# EAGLE design RadioBridge (EAGLE 8.2.2)
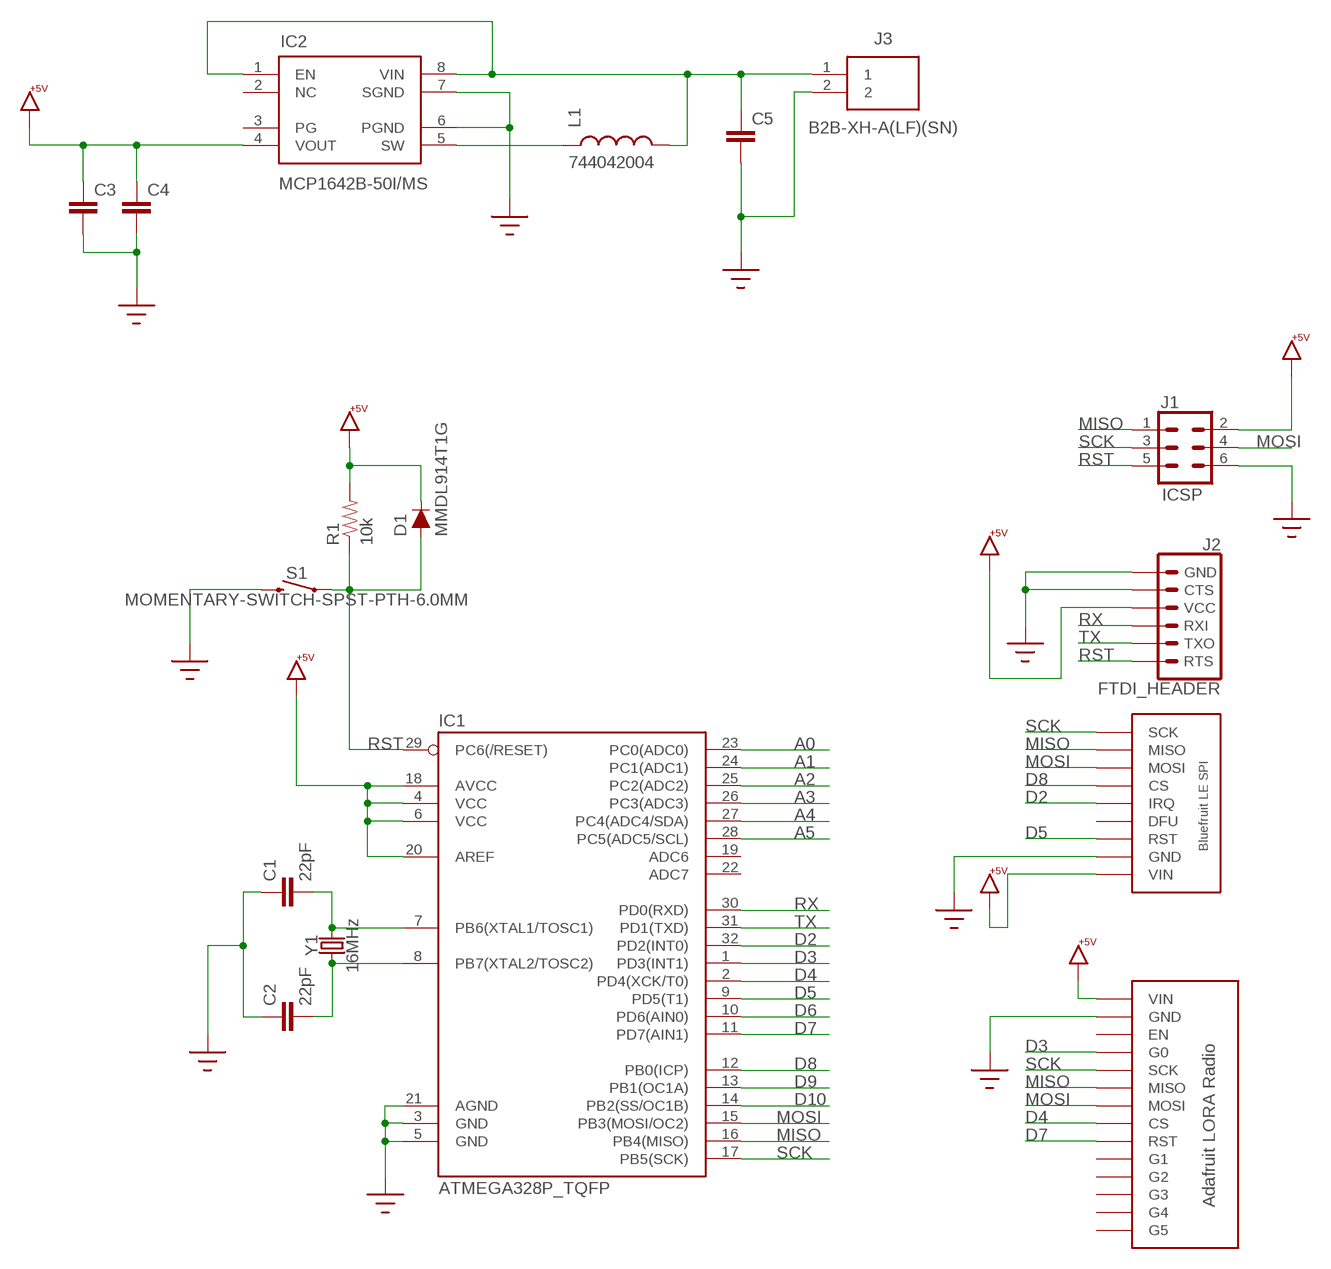
[diagram p0: schematic, sheet 1]

## Parts
C1  22pF  CAP0603-CAP  [0603-CAP]
C2  22pF  CAP0603-CAP  [0603-CAP]
C3  CAP0805  [0805]
C4  CAP0805  [0805]
C5  CAP0805  [0805]
D1  MMDL914T1G  DIODE-BAS16J  [SOD-323]
IC1  ATMEGA328P_TQFP  [TQFP32-08]
IC2  MCP1642B-50I/MS  [MSOP8]
J1  ICSP  CONN_03X22X3_SILK_MALE_PTH  [2X3]
J2  FTDI_HEADER  6_PIN_SERIAL_TARGETLOCK  [1X06_LOCK]
J3  B2B-XH-A(LF)(SN)  [SHDR2W64P0X250_1X2_740X575X700]
L1  744042004  INDUCTOR  [1919(4848_METRIC)]
R1  10k  RESISTOR0603-RES  [0603-RES]
S1  MOMENTARY-SWITCH-SPST-PTH-6.0MM  [TACTILE_SWITCH_PTH_6.0MM]
U$1  BLUEFRUIT_LE_FRIEND_SPI  [BLUEFRUIT_LE_FRIEND_SPI]
U$2  ADAFRUIT_LORA_RADIO  [ADAFRUIT_LORA_RADIO]
Y1  16MHz  CRYSTAL-16MHZSMD-5X3.2  [CRYSTAL-SMD-5X3.2-4PAD]

## Nets
+5V: C3.1 C4.1 D1.C IC1.4(VCC) IC1.6(VCC) IC1.18(AVCC) IC1.20(AREF) IC2.4(VOUT) J1.2 J2.4(VCC) R1.2 U$1.P$9(VIN) U$2.P$1(VIN)
A0: IC1.23(PC0(ADC0))
A1: IC1.24(PC1(ADC1))
A2: IC1.25(PC2(ADC2))
A3: IC1.26(PC3(ADC3))
A4: IC1.27(PC4(ADC4/SDA))
A5: IC1.28(PC5(ADC5/SCL))
D2: IC1.32(PD2(INT0)) U$1.P$5(IRQ)
D3: IC1.1(PD3(INT1)) U$2.P$4(G0)
D4: IC1.2(PD4(XCK/T0)) U$2.P$8(CS)
D5: IC1.9(PD5(T1)) U$1.P$7(RST)
D6: IC1.10(PD6(AIN0))
D7: IC1.11(PD7(AIN1)) U$2.P$9(RST)
D8: IC1.12(PB0(ICP)) U$1.P$4(CS)
D9: IC1.13(PB1(OC1A))
D10: IC1.14(PB2(SS/OC1B))
GND: C1.1 C2.1 C3.2 C4.2 C5.2 IC1.3(GND) IC1.5(GND) IC1.21(AGND) IC2.6(PGND) IC2.7(SGND) J1.6 J2.5(CTS) J2.6(GND) J3.2 S1.3 U$1.P$8(GND) U$2.P$2(GND)
MISO: IC1.16(PB4(MISO)) J1.1 U$1.P$2(MISO) U$2.P$6(MISO)
MOSI: IC1.15(PB3(MOSI/OC2)) J1.4 U$1.P$3(MOSI) U$2.P$7(MOSI)
N$1: C1.2 IC1.7(PB6(XTAL1/TOSC1)) Y1.3
N$2: C2.2 IC1.8(PB7(XTAL2/TOSC2)) Y1.1
REG_SW: IC2.5(SW) L1.P$1
REG_VIN: C5.1 IC2.1(EN) IC2.8(VIN) J3.1 L1.P$2
RST: D1.A IC1.29(PC6(/RESET)) J1.5 J2.1(RTS) R1.1 S1.1
RX: IC1.30(PD0(RXD)) J2.3(RXI)
SCK: IC1.17(PB5(SCK)) J1.3 U$1.P$1(SCK) U$2.P$5(SCK)
TX: IC1.31(PD1(TXD)) J2.2(TXO)
Unconnected: IC1.19(ADC6) IC1.22(ADC7) IC2.2(NC) IC2.3(PG) U$1.P$6(DFU) U$2.P$3(EN) U$2.P$10(G1) U$2.P$11(G2) U$2.P$12(G3) U$2.P$13(G4) U$2.P$14(G5)

## Library data of the parts
C1-C5 = SparkFun-Passives:CAP: Capacitor Standard 0603 ceramic capacitor, and 0.1" leaded capacitor.
D1 = SparkFun-DiscreteSemi:DIODE: Diode These are standard reverse protection diodes and small signal diodes. SparkFun Products: SparkFun SparkPunk Sound Kit <https://www.sparkfun.com/products/11177> SparkFun ESP8266 Thing <https://www.sparkfun.com/products/13231>; PROD_ID: DIO-09646; VALUE: 250mA/100V
IC1 = SparkFun-IC-Microcontroller:ATMEGA328P_TQFP: Popular 328P in QFP Storefront component: ATmega328 - TQFP <https://www.sparkfun.com/products/13448> (COM-13448) Datasheet <http://www.sparkfun.com/datasheets/Components/SMD/ATMega328.pdf> SparkFun Products SparkFun RedBoard - Programmed with Arduino <https://www.sparkfun.com/products/12757> (DEV-12757) Arduino Pro Mini 328 - 5V/16MHz <https://www.sparkfun.com/products/11113> (DEV-11113) Arduino Pro Mini 328 - 3.3V/8MHz <https://www.sparkfun.com/products/11114> (DEV-11114) SparkFun OpenLog <https://www.sparkfun.com/products/13712> (DEV-13712) SparkFun MicroView - OLED Arduino Module <https://www.sparkfun.com/products/12923> (DEV-12923) SparkFun Digital Sandbox <https://www.sparkfun.com/products/12651> (DEV-12651) SparkFun PicoBoard <https://www.sparkfun.com/products/11888> (WIG-11888) Arduino Fio <https://www.sparkfun.com/products/10116> (DEV-10116) LilyPad Arduino 328 Main Board <https://www.sparkfun.com/products/13342> (DEV-13342) SparkFun RedStick <https://www.sparkfun.com/products/13741> (DEV-13741) LilyPad MP3 <https://www.sparkfun.com/products/11013> (DEV-11013) LilyPad Arduino SimpleSnap <https://www.sparkfun.com/products/10941> (DEV-10941) SparkFun Stepoko <https://www.sparkfun.com/products/13899> (ROB-13899) SparkFun Geiger Counter <https://www.sparkfun.com/products/11345> (SEN-11345) SparkFun EL Sequencer <https://www.sparkfun.com/products/12781> (COM-12781) Arduino Pro 328 - 5V/16MHz <https://www.sparkfun.com/products/10915> (DEV-10915) CryptoCape <https://www.sparkfun.com/products/12773> (DEV-12773) SparkFun IR Thermometer Evaluation Board - MLX90614 <https://www.sparkfun.com/products/10740> (SEN-10740) SparkFun RedBot Mainboard <https://www.sparkfun.com/products/12097> (ROB-12097) Arduino Pro 328 - 3.3V/8MHz <https://www.sparkfun.com/products/10914> (DEV-10914) SparkFun Block for Intel® Edison - Arduino <https://www.sparkfun.com/products/13036> (DEV-13036) SparkFun Simon Says - Surface Mount Soldering Kit <https://www.sparkfun.com/products/10935> (KIT-10935) SparkFun 7-Segment Serial Display - Red <https://www.sparkfun.com/products/11441> (COM-11441) SparkFun 7-Segment Serial Display - White <https://www.sparkfun.com/products/11629> (COM-11629) SparkFun 7-Segment Serial Display - Yellow <https://www.sparkfun.com/products/11443> (COM-11443) SparkFun 7-Segment Serial Display - Kelly Green <https://www.sparkfun.com/products/11440> (COM-11440) SparkFun 7-Segment Serial Display - Blue <https://www.sparkfun.com/products/11442> (COM-11442) SparkFun OpenSegment Serial Display - 20mm (Blue) <https://www.sparkfun.com/products/11647> (COM-11647) SparkFun OpenSegment Serial Display - 20mm (Green) <https://www.sparkfun.com/products/11646> (COM-11646) SparkFun OpenSegment Serial Display - 20mm (White) <https://www.sparkfun.com/products/11648> (COM-11648) SparkFun OpenSegment Serial Display - 20mm (Red) <https://www.sparkfun.com/products/11644> (COM-11644) SparkFun OpenSegment Serial Display - 20mm (Yellow) <https://www.sparkfun.com/products/11645> (COM-11645) SparkFun OpenSegment Shield <https://www.sparkfun.com/products/13190> (DEV-13190); PROD_ID: IC-09069
IC2 = SparkFun-IC-Power:MCP1642B-50I/MS
J1 = SparkFun-Connectors:CONN_03X2: Multi connection point. Often used as Generic Header-pin footprint for 0.1 inch spaced/style header connections You can populate with any combo of single row headers, but if you'd like an exact match, check these: Header - 2x3 (Male, 0.1") <https://www.sparkfun.com/products/12807> (PRT-12807) Header - 2x3 (Female, 0.1") <https://www.sparkfun.com/products/13010> (PRT-13010) 2x3 Pin Shrouded Header <https://www.sparkfun.com/products/10877> (PRT-10877) On any of the 0.1 inch spaced packages, you can populate with these: Break Away Headers - Straight <https://www.sparkfun.com/products/116> (PRT-00116) Break Away Male Headers - Right Angle <https://www.sparkfun.com/products/553> (PRT-00553) Female Headers <https://www.sparkfun.com/products/115> (PRT-00115) Break Away Headers - Machine Pin <https://www.sparkfun.com/products/117> (PRT-00117) Break Away Female Headers - Swiss Machine Pin <https://www.sparkfun.com/products/743> (PRT-00743) Special note: the shrouded connector mates well with our 3x2 ribbon cables: Ribbon Crimp Connector - 6-pin (2x3, Female) <https://www.sparkfun.com/products/10651> (PRT-10651) Ribbon Cable - 6 wire (15ft) <https://www.sparkfun.com/products/10646> (PRT-10646); PROD_ID: CONN-09701
J2 = TinkerTech:6_PIN_SERIAL_TARGET: 6-pin header connection for use with the "FTDI BASIC" pinout - TARGET SIDE. Also known as "Arduino Serial Program Header". It is used to mate with our FTDI Basic serial programmers using the Arduino IDE. Note, this device has "TARGET" in the name. It is intended to be used on a design that contains a target micro-controller that you wish to program. The "sister" device, named "CABLE" is inteneded to be used on a design that usually lives on the end of your USB cable and prvides the converter chip (FTDI232 or FTDI231x) to commnicate serial RX/TX. You can populate with some of these: Break Away Headers - Straight <https://www.sparkfun.com/products/116> (PRT-00116) For reference (or to suit your programming needs) check out these designs: SparkFun FTDI Basic Breakout - 5V <https://www.sparkfun.com/products/9716> (DEV-09716) SparkFun FTDI Basic Breakout - 3.3V <https://www.sparkfun.com/products/9873> (DEV-09873) SparkFun FTDI SmartBasic <https://www.sparkfun.com/products/12935> (DEV-12935) SparkFun Beefy 3 - FTDI Basic Breakout <https://www.sparkfun.com/products/13746> (DEV-13746)
J3 = B2B-XH-A(LF)(SN):B2B-XH-A(LF)(SN): JST XH Series, 2.5mm Pitch 2 Way 1 Row Straight PCB Header, Solder Termination, 3A <https://componentsearchengine.com/Images/3/B2B-XH-A%28LF%29%28SN%29.jpg> Source: Datasheet <http://docs-europe.electrocomponents.com/webdocs/1357/0900766b81357f2f.pdf>; DESCRIPTION: JST XH Series, 2.5mm Pitch 2 Way 1 Row Straight PCB Header, Solder Termination, 3A; HEIGHT: 7mm; MANUFACTURER_NAME: JST (JAPAN SOLDERLESS TERMINALS); MANUFACTURER_PART_NUMBER: B2B-XH-A(LF)(SN); RS_PART_NUMBER: 8201554; SUPPLIER_NAME: RS
L1 = SparkFun-Passives:INDUCTOR: Inductors Basic Inductor/Choke - 0603 and 1206. Footprints are not proven and vary greatly between part numbers.
R1 = SparkFun-Passives:RESISTOR: Resistor Basic schematic elements and footprints for 0603, 1206, and PTH resistors.
S1 = SparkFun-Switches:MOMENTARY-SWITCH-SPST: Momentary Switch (Pushbutton) - SPST Normally-open (NO) SPST momentary switches (buttons, pushbuttons). Variants PTH-12MM - 12mm square, through-hole Momentary Pushbutton Switch - 12mm Square <https://www.sparkfun.com/products/9190> (COM-09190) PTH-6.0MM, PTH-6.0MM-KIT - 6.0mm square, through-hole Mini Pushbutton Switch <https://www.sparkfun.com/products/97> (COM-00097) KIT package intended for soldering kit's - only one side of pads' copper is exposed. PTH-RIGHT-ANGLE-KIT - Right-angle, through-hole Right Angle Tactile Button <https://www.sparkfun.com/products/10791> - Used on SparkFun BigTime Watch Kit <https://www.sparkfun.com/products/11734> SMD-12MM - 12mm square, surface-mount Tactile Button - SMD (12mm) <https://www.sparkfun.com/products/12993> (COM-12993) Used on SparkFun PicoBoard <https://www.sparkfun.com/products/11888> SMD-4.5MM - 4.5mm Square Trackball Switch Used on SparkFun Blackberry Trackballer Breakout <https://www.sparkfun.com/products/13169> SMD-4.6MMX2.8MM - 4.60mm x 2.80mm, surface mount Used on SparkFun SAMD21 Mini Breakout <https://www.sparkfun.com/products/13664> SMD-5.2MM, SMD-5.2-REDUNDANT - 5.2mm square, surface-mount Mini Pushbutton Switch - SMD <https://www.sparkfun.com/products/8720> (COM-08720) Used on Arduino Pro Mini <https://www.sparkfun.com/products/11114> REDUNDANT package connects both switch circuits together SMD-6.0X3.5MM - 6.0 x 3.5mm, surface mount Momentary Reset Switch SMD <https://www.sparkfun.com/products/8229> (COM-08229) SMD-6.2MM-TALL - 6.2mm square, surface mount Tactile Button - SMD (6mm) <https://www.sparkfun.com/products/12992> Used on SparkFun Digital Sandbox <https://www.sparkfun.com/products/12651> SMD-RIGHT-ANGLE - Right-angle, surface mount Used on SparkFun Block for Intel® Edison - Arduino <https://www.sparkfun.com/products/13036>; PROD_ID: SWCH-08441; SF_SKU: COM-00097
U$1 = TinkerTech:BLUEFRUIT_LE_FRIEND_SPI
U$2 = TinkerTech:ADAFRUIT_LORA_RADIO
Y1 = SparkFun-Clocks:CRYSTAL-16MHZ: 16MHz Crystal Digikey Example <http://www.digikey.com/product-search/en?keywords=535-9122-1-ND> Frequency: 16MHz Frequency Stability: ±50ppm Frequency Tolerance: ±20ppm Load Capacitance: 18pF SparkFun Products: Pro Micro -5V/16MHz <https://www.sparkfun.com/products/12640> SparkFun Serial Enabled LCD Kit <https://www.sparkfun.com/products/10097>; PROD_ID: XTAL-08218; SF_ID: COM-00094

## Board
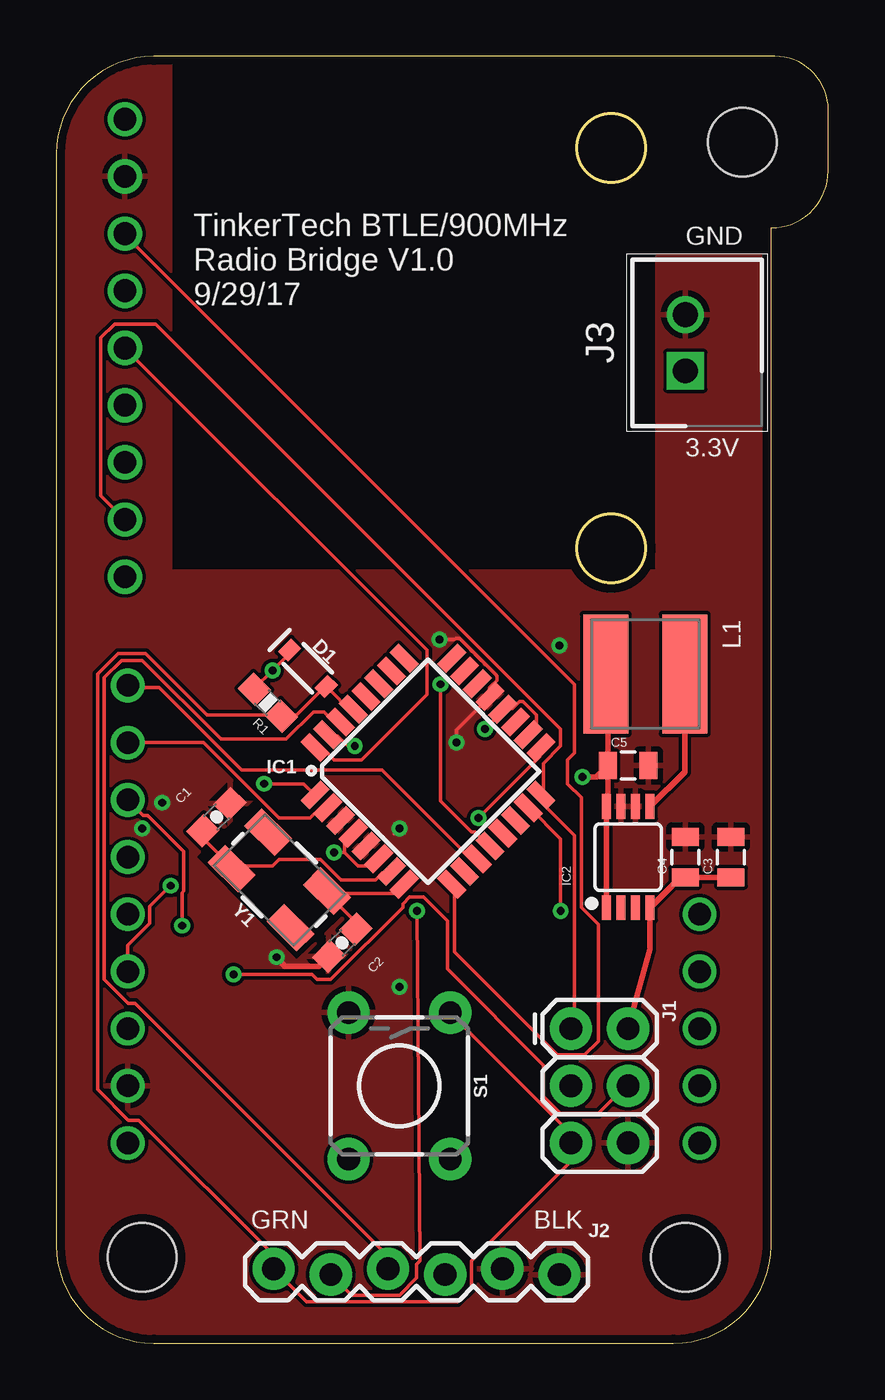
[diagram p1: board, top side]
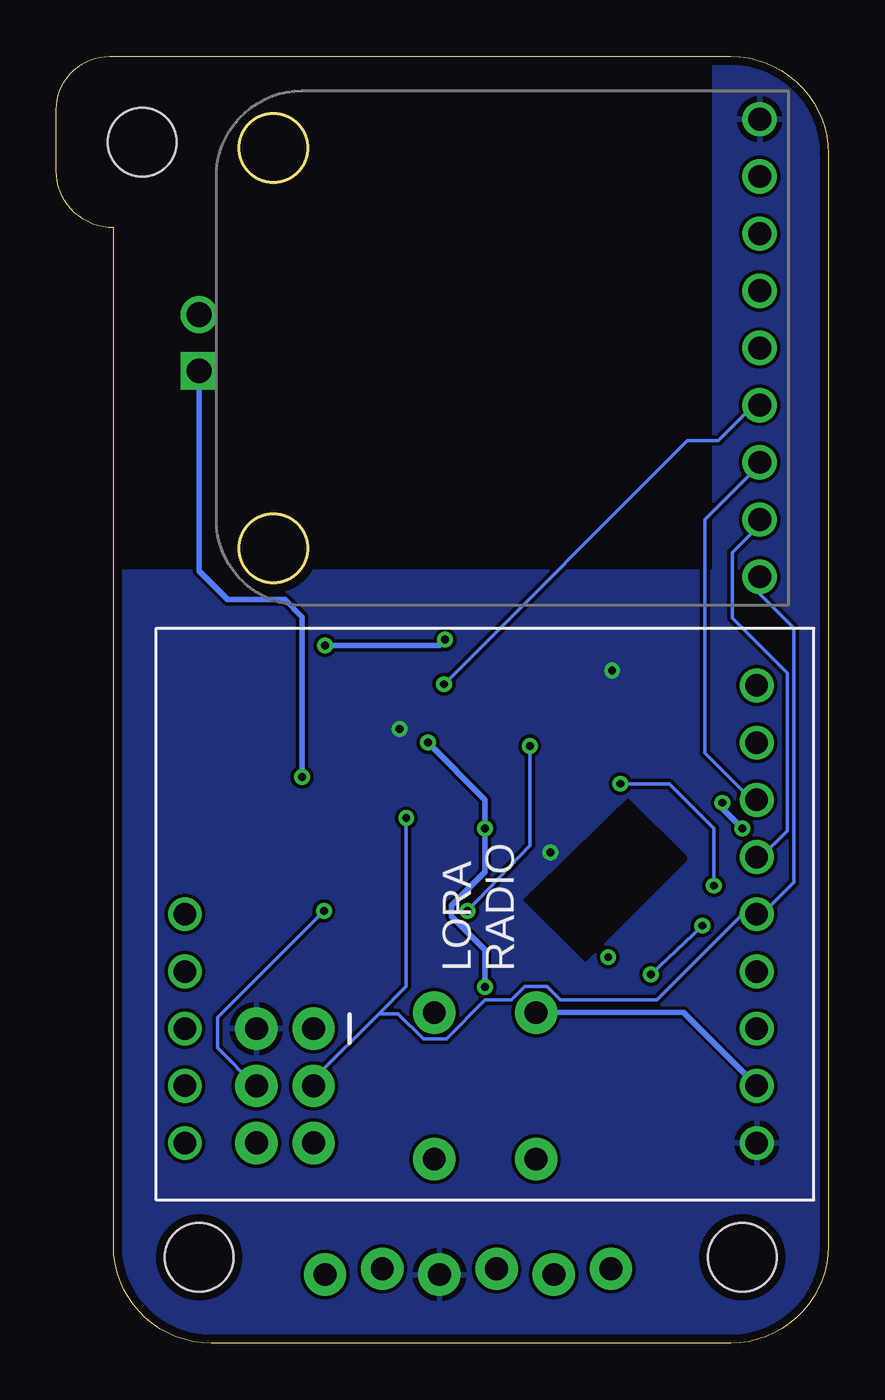
[diagram p2: board, bottom side, seen from below]

Size 34.29 x 57.15 mm. Coordinates in mm from the lower left corner, seen from the top.
Outline: 31.91,57.15 4.34,57.15 arc90 0,52.81 0,4.34 arc90 4.34,0 27.41,0 arc90 31.75,4.34 31.75,49.53 arc90 34.29,52.07 34.29,54.77 arc90 31.91,57.15
Copper layers (1*16): Top 0.0356mm / dielectric 1.5011mm / Bottom 0.0356mm
Design rules "oshpark-2layer *": minimum track width 6mil, minimum drill 13mil, track to track 6mil, track to pad 6mil, pad to pad 6mil, via to via 6mil, smd to smd 6mil, copper to edge 15mil, drill to drill 6mil, minimum pad ring 7mil, minimum via ring 7mil, stop-mask expansion 2.5mil, vias tented up to drill 15mil, thermal gap 10mil
Holes 3.05 mm at 3.81,3.81 30.48,53.34 27.94,3.81
tKeepout: area 1,1 to 6.6,6.6; area 27.7,50.5 to 33.3,56.1; area 25.1,1 to 30.7,6.6
tRestrict: 10 lines

### Footprints (pad centres in the part's own frame; a part is rotated, then mirrored left to right if it is on the bottom)
0603-CAP = smd 1.1 x 1: 1 -0.85,0; 2 0.85,0
0805 = smd 0.8 x 1.2: 1 -0.9,0; 2 0.9,0
SOD-323 = smd 0.63 x 0.83: A 1.15,0; C -1.15,0
TQFP32-08 = smd 1.27 x 0.559: 1 -4.293,2.8; 2 -4.293,2; 3 -4.293,1.2; 4 -4.293,0.4; 5 -4.293,-0.4; 6 -4.293,-1.2; 7 -4.293,-2; 8 -4.293,-2.8; 17 4.293,-2.8; 18 4.293,-2; 19 4.293,-1.2; 20 4.293,-0.4; 21 4.293,0.4; 22 4.293,1.2; 23 4.293,2; 24 4.293,2.8 | smd 0.559 x 1.27: 9 -2.8,-4.293; 10 -2,-4.293; 11 -1.2,-4.293; 12 -0.4,-4.293; 13 0.4,-4.293; 14 1.2,-4.293; 15 2,-4.293; 16 2.8,-4.293; 25 2.8,4.293; 26 2,4.293; 27 1.2,4.293; 28 0.4,4.293; 29 -0.4,4.293; 30 -1.2,4.293; 31 -2,4.293; 32 -2.8,4.293
MSOP8 = smd 0.4 x 1.1: 1 -0.975,-2.25; 2 -0.325,-2.25; 3 0.325,-2.25; 4 0.975,-2.25; 5 0.975,2.25; 6 0.325,2.25; 7 -0.325,2.25; 8 -0.975,2.25
2X3 = drill 1.016 pad 1.88: 1 0,0; 2 0,2.54; 3 2.54,0; 4 2.54,2.54; 5 5.08,0; 6 5.08,2.54
1X06_LOCK = drill 1.016 pad 1.88: 1 0,0; 2 2.54,-0.254; 3 5.08,0; 4 7.62,-0.254; 5 10.16,0; 6 12.7,-0.254
SHDR2W64P0X250_1X2_740X575X700 = drill 1.1 pad 1.65 square: 1 0,0 | drill 1.1 pad 1.65: 2 2.5,0
1919(4848_METRIC) = smd 5.3 x 2: P$1 0,1.75; P$2 0,-1.75
0603-RES = smd 1.1 x 1: 1 -0.85,0; 2 0.85,0
TACTILE_SWITCH_PTH_6.0MM = drill 1.016 pad 1.88: 1 -3.251,2.261; 2 3.251,2.261; 3 -3.251,-2.261; 4 3.251,-2.261
BLUEFRUIT_LE_FRIEND_SPI = drill 1.016: P$1 -10.16,-11.43; P$2 -7.62,-11.43; P$3 -5.08,-11.43; P$4 -2.54,-11.43; P$5 0,-11.43; P$6 2.54,-11.43; P$7 5.08,-11.43; P$8 7.62,-11.43; P$9 10.16,-11.43
ADAFRUIT_LORA_RADIO = drill 1: P$1 -10.16,-12.065; P$2 -7.62,-12.065; P$3 -5.08,-12.065; P$4 -2.54,-12.065; P$5 0,-12.065; P$6 2.54,-12.065; P$7 5.08,-12.065; P$8 7.62,-12.065; P$9 10.16,-12.065; P$10 -10.16,13.335; P$11 -7.62,13.335; P$12 -5.08,13.335; P$13 -2.54,13.335; P$14 0,13.335
CRYSTAL-SMD-5X3.2-4PAD = smd 1.9 x 1.1: 1 -1.85,-1.15; 2 1.85,-1.15; 3 1.85,1.15; 4 -1.85,1.15

### Placement (x,y rotation side)
C1  7.11,23.37 225 top
C2  12.7,17.78 45 top
C3  29.97,21.59 90 top
C4  27.94,21.59 90 top
C5  25.4,25.65 0 top
D1  11.18,29.97 315 top
IC1  16.51,25.4 45 top
IC2  25.4,21.59 0 top
J1  22.86,13.97 270 top
J2  9.65,3.3 0 top
J3  27.94,43.18 90 top
L1  26.16,29.72 270 top
R1  9.4,28.45 135 top
S1  15.24,11.43 270 top
U$1  14.48,44.2 90 bottom
U$2  15.24,19.05 90 bottom
Y1  9.91,20.57 135 top

### Tracks (layer width: path | path; a pad name or v marks a point on that pad's centre or on a via)
+5V  (via drill 0.35)
  Top 0.152: D1.C 10.21,30.79 10.21,30.48 v9.6,29.87 8.84,29.11 R1.2 | 12.8,21.79 13.41,21.18 13.87,21.18 14.17,21.49 IC1.6 | 12.8,21.79 12.8,22.25 13.11,22.55 IC1.4 | IC1.18 21.03,27.13 21.34,27.43 21.34,27.89 20.73,28.5 20.57,28.5 20.27,28.19 19.96,28.19 IC1.20 19.81,28.04 v19.05,27.28 | v12.34,21.79 12.8,21.79
  Top 0.254: C3.1 C4.1 27.73,20.69 IC2.4 26.38,17.48 J1.2
  pour Bottom: 0,57.15 5.08,57.15 5.08,34.29 31.75,34.29 31.75,0 0,0
D2
  Top 0.152: U$1.P$5 16.46,30.79 16.46,28.8 13.56,25.91 12.34,25.91 11.89,26.36 11.58,26.36 IC1.32
D3  (via drill 0.35)
  Top 0.152: IC1.1 10.99,24.84 v9.24,24.84 | v5.08,20.32 4.16,19.4 4.16,18.64 3.17,17.66 U$2.P$4
  Bottom 0.152: v5.08,20.32 5.08,22.86 7.06,24.84 v9.24,24.84
D4
  Top 0.152: U$2.P$8 6.55,26.67 9.91,23.32 11.28,23.32 11.73,23.77 12.04,23.77 IC1.2
D5
  Top 0.152: IC1.9 17.68,20.27 17.68,17.37 22.25,12.8 23.47,12.8 24.08,13.41 24.08,18.59 23.32,19.36 23.32,24.23 22.71,24.84 22.71,25.91 23.01,26.21 23.01,29.26 3.05,49.23 U$1.P$7
D7
  Top 0.152: IC1.11 18.59,21.64 18.29,21.64 14.48,25.45 8.23,25.45 4.57,29.11 3.2,29.11 U$2.P$9
D8  (via drill 0.35)
  Top 0.152: v17.07,29.26 17.07,24.08 18.44,22.71 18.59,22.71 19.2,22.1 IC1.12
  Bottom 0.152: v17.07,29.26 6.25,40.08 4.88,40.08 3.35,41.6 3.05,41.6 U$1.P$4
GND  (via drill 0.35)
  Top 0.152: v17.02,31.24 17.67,31.24 17.72,31.29 17.91,31.29 19.57,29.63 19.57,29.44 19.26,29.13 IC1.21 17.78,27.24 v17.78,26.67 | 15,22.62 v15.24,22.86
  Top 0.254: C2.1 11.66,16.74 10.16,16.74 9.78,17.12 v9.78,17.14
  Bottom 0.254: v17.02,31.24 17.27,30.99 v22.35,30.99 | v17.78,26.67 15.24,24.13 v15.24,22.86 15.24,20.94 16.74,19.44 16.74,18.96 15.24,17.47 v15.24,15.82 | U$2.P$2 6.43,14.68 S1.3 | v3.81,22.86 4.7,23.75 v4.7,24
  pour Top: 0,57.15 5.08,57.15 5.08,34.29 26.67,34.29 26.67,48.26 31.75,48.26 31.75,0 0,0
MISO
  Top 0.152: J1.1 22.86,14.02 23.01,14.17 23.01,22.55 21.64,23.93 21.64,24.23 IC1.16 21.64,24.38 21.64,25.76 22.4,26.52 22.4,27.28 4.42,45.26 2.59,45.26 1.98,44.65 1.98,37.64 U$1.P$2
  Bottom 0.152: U$1.P$2 3.05,36.32 4.27,35.1 4.27,32.21 1.83,29.77 1.83,22.76 3.05,21.54 U$2.P$6
MOSI  (via drill 0.35)
  Top 0.152: v22.4,19.2 22.4,22.4 21.03,23.77 IC1.15 | v7.87,16.38 11.35,16.38 11.58,16.15 12.19,16.15 15.39,19.36 15.39,19.51 15.7,19.81 16.31,19.81 17.37,18.75 17.37,16.61 21.64,12.34 21.64,10.97 22.4,10.21 24.08,10.21 25.3,11.43 J1.4 | U$2.P$7 3.86,23.44 4.05,23.44 5.66,21.83 5.66,20.08 5.59,20.01 v5.59,18.54
  Bottom 0.152: U$2.P$7 3.2,24.23 3.5,24.23 5.49,26.21 5.49,36.58 3.05,39.01 U$1.P$3 | v22.4,19.2 27.13,14.48 27.13,13.11 25.45,11.43 J1.4 | v7.87,16.38 v5.59,18.54
N$1
  Top 0.152: C1.2 6.55,22.71 6.55,22.4 7.77,21.18 Y1.3 7.92,21.18 9.6,21.18 9.91,21.49 11.73,21.49 12.65,20.57 14.17,20.57 14.48,20.88 14.78,20.88 IC1.7
N$2
  Top 0.152: 12.04,19.96 13.26,18.75 13.26,18.44 C2.2 13.41,18.29 | 12.04,19.96 Y1.1 | IC1.8 15.39,20.27 15.09,19.96 12.04,19.96
N$3
  cutout Bottom: 6.35,21.59 8.89,24.13 13.46,19.68 10.79,17.02 6.35,21.46
N$4
  cutout Top: 8.89,24.13 13.34,19.68 10.67,17.14 6.35,21.59
REG_SW
  Top 0.254: L1.P$1 27.91,25.38 IC2.5
REG_VIN  (via drill 0.35)
  Top 0.254: C5.1 24.5,23.91 IC2.8 IC2.1 | C5.1 23.99,25.15 v23.37,25.15 | L1.P$2 24.5,29.63 C5.1
  Bottom 0.254: v23.37,25.15 23.37,32.26 24.13,33.02 26.67,33.02 27.94,34.29 J3.1
RST
  Top 0.152: S1.1 17.53,14.63 22.86,9.3 J1.5 22.86,8.08 18.44,3.66 18.44,2.44 17.83,1.83 11.12,1.83 J2.1 9.6,3.35 9.6,3.96 3.66,9.91 3.2,9.91 1.83,11.28 1.83,29.72 2.74,30.63 3.96,30.63 6.71,27.89 9.91,27.89 R1.1 10.06,27.89 10.67,27.89 11.89,29.11 D1.A 12.04,29.11 13.11,28.04 IC1.29
RX
  Top 0.152: IC1.30 12.5,27.74 12.19,27.74 11.89,28.04 11.43,28.04 10.21,26.82 7.32,26.82 3.81,30.33 2.9,30.33 2.13,29.57 2.13,16.15 3.2,15.09 3.5,15.09 14.63,3.96 14.63,3.35 J2.3
SCK  (via drill 0.35)
  Top 0.152: v18.75,23.32 21.49,26.06 21.49,26.36 IC1.17
  Bottom 0.152: U$1.P$1 3.05,33.27 1.52,31.75 1.52,20.47 3.05,18.95 U$2.P$5 3.81,19.05 7.62,15.24 11.89,15.24 12.49,15.85 13.46,15.85 14.07,15.24 15.24,15.24 16.97,13.51 17.98,13.51 19.11,14.63 19.96,14.63 | v18.75,23.32 18.75,15.85 19.96,14.63 | 19.96,14.63 22.86,11.73 J1.3
TX  (via drill 0.35)
  Top 0.152: v13.26,26.52 12.95,26.52 12.5,26.98 12.19,26.98 IC1.31 | v16.03,19.2 16.15,3.66 16,3.5 16,2.9 15.24,2.13 13.11,2.13 J2.2
  Bottom 0.152: v13.26,26.52 13.26,22.1 v16.03,19.2

### Text on the board
tPlace: GND | TinkerTech BTLE/900MHz / Radio Bridge V1.0 / 9/29/17 | 3.3V | GRN | BLK